# Altium schematic sheet Sheet_1_2023-07-15.schdoc
size 291 x 216 mm
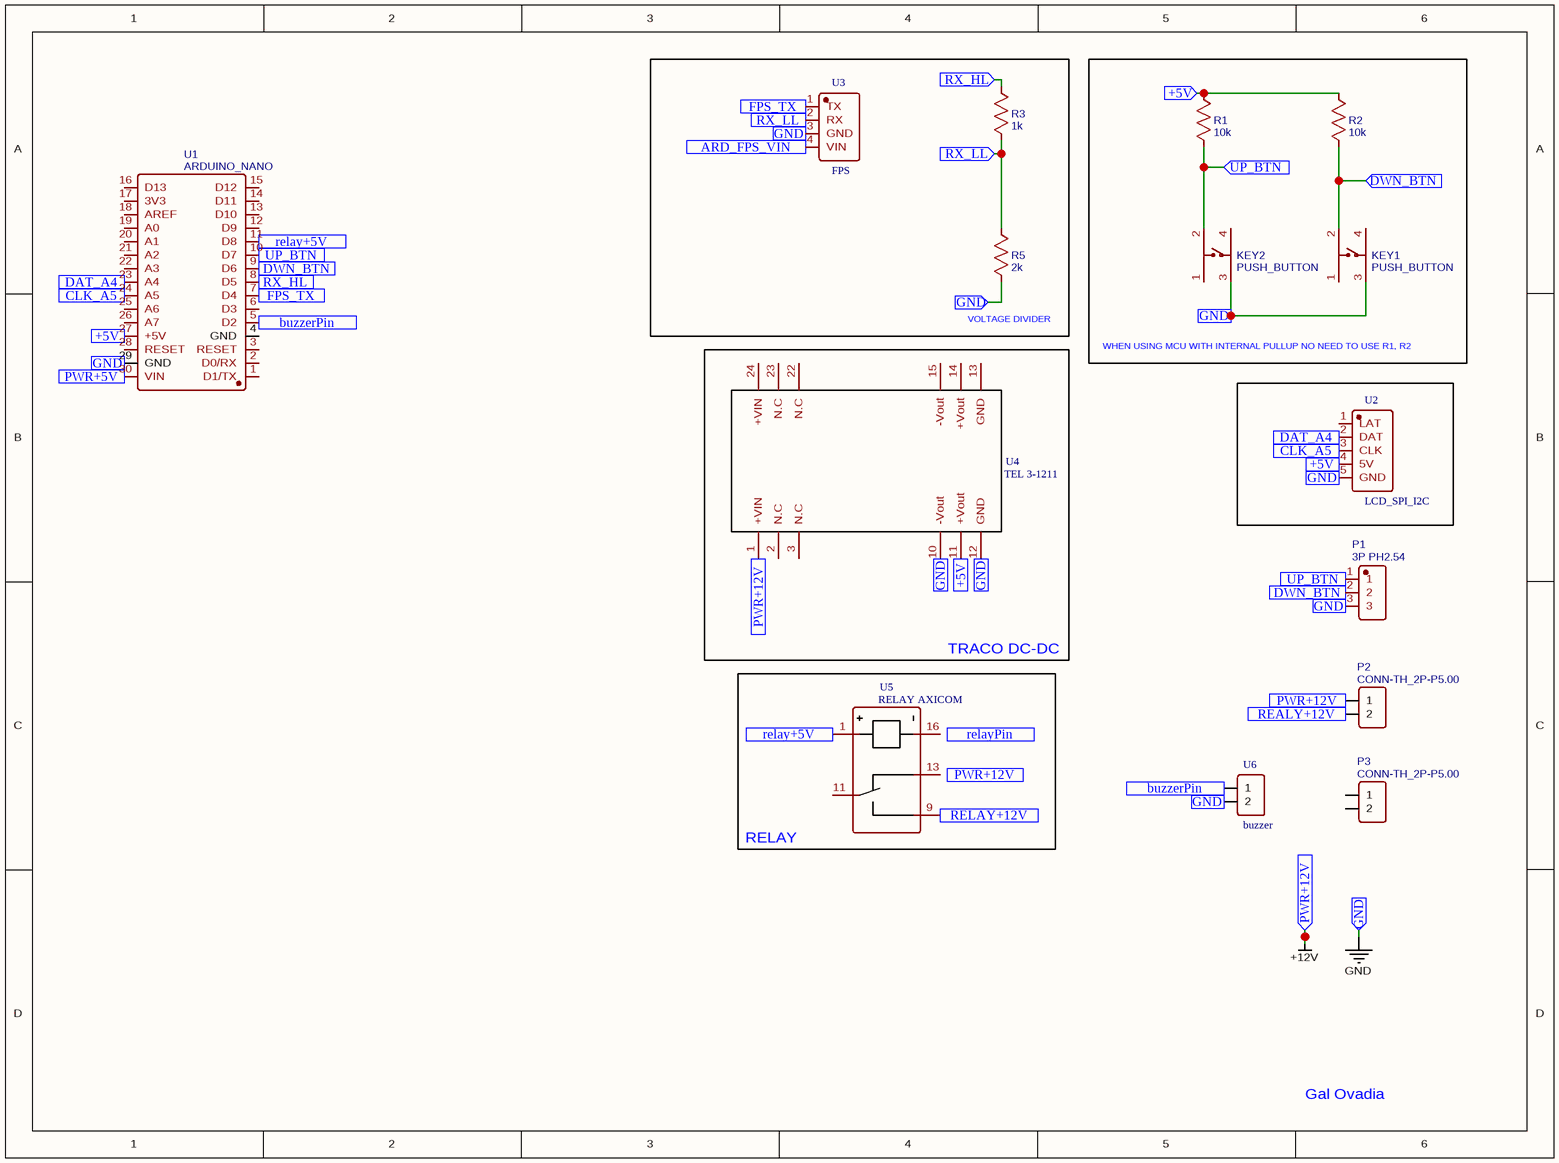
[diagram p0: Sheet_1_2023-07-15.schdoc]

## Parts
KEY1  PUSH_BUTTON  [SW-SMD_4P-L6.0-W6.0-P4.50-LS10.0_TL3301EF160QG]
KEY2  PUSH_BUTTON  [SW-SMD_4P-L6.0-W6.0-P4.50-LS10.0_TL3301EF160QG]
P1  3P PH2.54  [CONN-TH_3P-P2.50_3PIN]
P2  CONN-TH_2P-P5.00  [CONN-TH_2P-P5.00]
P3  CONN-TH_2P-P5.00  [CONN-TH_2P-P5.00]
R1  10k  [R0603]
R2  10k  [R0603]
R3  1k  [R0603]
R5  2k  [R0603]
U1  ARDUINO_NANO  [COMM-TH_ARDUINO_NANO]
U2  LCD_SPI_I2C
U3  FPS
U4  TEL 3-1211
U5  RELAY AXICOM
U6  buzzer

## Blocks framed on the sheet
VOLTAGE DIVIDER: R3 R5 U3
WHEN USING MCU WITH INTERNAL PULLUP NO NEED TO USE R1, R2: KEY1 KEY2 R1 R2
TRACO DC-DC: U4

## Ports
+5V (in), ARD_FPS_VIN (in), buzzerPin (in), CLK_A5 (in), DAT_A4 (in), DWN_BTN (in), FPS_TX (in), GND (in), PWR+5V (in), PWR+12V (in), REALY+12V (in), relay+5V (in), RELAY+12V (in), relayPin (in), RX_HL (in), RX_LL (in), UP_BTN (in)

## Nets
+12V: P2.1 U4.1(+VIN) ; port PWR+12V
GND: KEY1.3 KEY2.3 P1.3 R5.1 U1.29(GND) U2.5(GND) U3.3(GND) U4.10(-Vout) U4.12(GND) U6.2 ; port GND
+5V: R1.2 R2.2 U1.27(+5V) U2.4(5V) U4.11(+Vout) ; port +5V
ARD_FPS_VIN: U3.4(VIN) ; port ARD_FPS_VIN
buzzerPin: U1.5(D2) U6.1 ; port buzzerPin
CLK_A5: U1.24(A5) U2.3(CLK) ; port CLK_A5
DAT_A4: U1.23(A4) U2.2(DAT) ; port DAT_A4
DWN_BTN: KEY1.2 P1.2 R2.1 U1.9(D6) ; port DWN_BTN
FPS_TX: U1.7(D4) U3.1(TX) ; port FPS_TX
PWR+5V: U1.30(VIN) ; port PWR+5V
REALY+12V: P2.2 ; port REALY+12V
relay+5V: U1.11(D8) U5.1 ; port relay+5V
RELAY+12V: U5.9 ; port RELAY+12V
RX_HL: R3.2 U1.8(D5) ; port RX_HL
RX_LL: R3.1 R5.2 U3.2(RX) ; port RX_LL
UP_BTN: KEY2.2 P1.1 R1.1 U1.10(D7) ; port UP_BTN

Not connected (* = marked no-connect by the designer): KEY1 1 4; KEY2 1 4; P3 1 2; U1 1(D1/TX) 2(D0/RX) 3(RESET) 4(GND) 6(D3) 12(D9) 13(D10) 14(D11) 15(D12) 16(D13) 17(3V3) 18(AREF) 19(A0) 20(A1) 21(A2) 22(A3) 25(A6) 26(A7) 28(RESET); U2 1(LAT); U4 2(N.C) 3(N.C) 13(GND) 14(+Vout) 15(-Vout) 22(N.C) 23(N.C) 24(+VIN); U5 11(3) 13(7) 16(8)

## Notes on the sheet
- RELAY
- Gal Ovadia

## Library data of the parts
KEY1 KEY2 = PUSH_BUTTON: BOM_Manufacturer: null; BOM_Manufacturer Part: 4pinTACTPCBTHTPushButton; Contributor: LCSC; BOM_Supplier: LCSC; BOM_Supplier Part: C9900003768; BOM_JLCPCB Part Class: Extended Part; spicePre: K; spiceSymbolName: 4PINTACTPCBTHTPUSHBUTTON
P1 = 3P PH2.54: Contributor: LCSC; BOM_Supplier: LCSC; BOM_Supplier Part: C9900006188; BOM_Manufacturer Part: 3P PH2.54; BOM_JLCPCB Part Class: Extended Part; spicePre: C; spiceSymbolName: 3P PH2.54
P2 P3 = CONN-TH_2P-P5.00: Contributor: LCEDA_Lib; BOM_Supplier: LCSC; spicePre: P; spiceSymbolName: CONN-TH_2P-P5.00
R1 R2 = 10k: nameAlias: Value(Ω); Contributor: LCEDA_Lib; spicePre: R; spiceSymbolName: R_0603_US
R3 = 1k: nameAlias: Value(Ω); Contributor: LCEDA_Lib; spicePre: R; spiceSymbolName: R_0603_US
R5 = 2k: nameAlias: Value(Ω); Contributor: LCEDA_Lib; spicePre: R; spiceSymbolName: R_0603_US
U1 = ARDUINO_NANO: BOM_Manufacturer: null; Contributor: lcsc; BOM_Supplier: LCSC; BOM_Supplier Part: C9900017879; BOM_Manufacturer Part: ARDUINO_NANO; BOM_JLCPCB Part Class: Extended Part; spicePre: U; spiceSymbolName: ARDUINO_NANO